# EAGLE design i2c touch sensor (EAGLE 5.10)
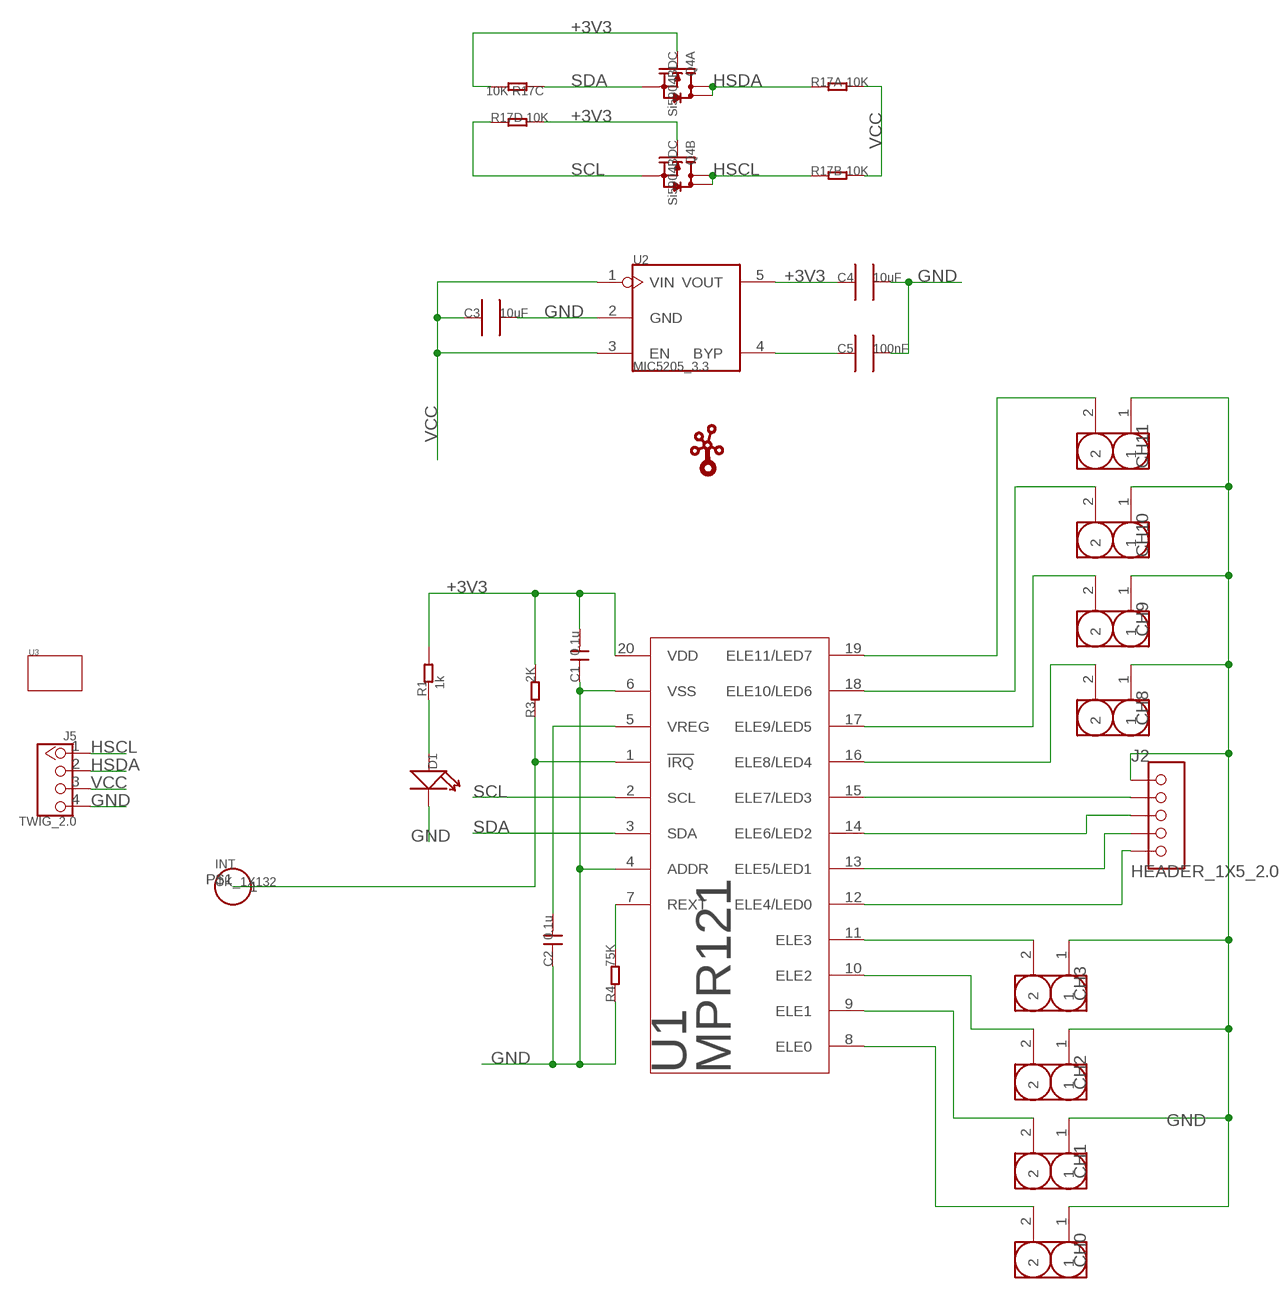
[diagram p0: schematic, sheet 1]

## Parts
C1  0.1u  006-C0603  [0603]
C2  0.1u  006-C0603  [0603]
C3  10uF  C0805_S  [0805_S]
C4  10uF  C0805_S  [0805_S]
C5  100nF  C0603_S  [0603_S]
CH0  HEADER_1X2_2.0  HEADER-2P  [2P-2.0-0.7MM/]
CH1  HEADER_1X2_2.0  HEADER-2P  [2P-2.0-0.7MM/]
CH2  HEADER_1X2_2.0  HEADER-2P  [2P-2.0-0.7MM/]
CH3  HEADER_1X2_2.0  HEADER-2P  [2P-2.0-0.7MM/]
CH8  HEADER_1X2_2.0  HEADER-2P  [2P-2.0-0.7MM/]
CH9  HEADER_1X2_2.0  HEADER-2P  [2P-2.0-0.7MM/]
CH10  HEADER_1X2_2.0  HEADER-2P  [2P-2.0-0.7MM/]
CH11  HEADER_1X2_2.0  HEADER-2P  [2P-2.0-0.7MM/]
D1  LED-0805  [D0805]
INT  CK_1X132  [CK_1X1]
J2  HEADER_1X5_2.0  [2.0_1X5P]
J5  TWIG_2.0  [2.0_1X4]
Q4  Si5904BDC  010-DUAL-N-MOSFET_1206-8  [1206-8]
R1  1k  R0603  [0603]
R3  2K  005-R0603  [0603]
R4  75K  005-R0603  [0603]
R17  10K  005-4R_1206  [R1206-8]
U1  MPR121  [MPR121]
U2  MIC5205_3.3  MIC5025_X.X  [SOT23-5]
U3  TWIG-2U  [2U-DIM-W/-DRILL]
U$2  TWIGLOGOTWIGLOGO_SMALL  [TWIGLOGO_SMALL]

## Nets
+3V3: C1.2 C4.1 Q4.2(A:G) Q4.4(B:G) R1.2 R3.2 R17.5 R17.6 U1.20(VDD) U2.5(VOUT)
GND: C1.1 C2.1 C3.2 C4.2 C5.2 CH0.1 CH1.1 CH2.1 CH3.1 CH8.1 CH9.1 CH10.1 CH11.1 D1.- J2.1 J5.4 R4.1 U1.4(ADDR) U1.6(VSS) U2.2(GND)
HSCL: J5.1 Q4.5(B:D) Q4.6(B:D) R17.2
HSDA: J5.2 Q4.7(A:D) Q4.8(A:D) R17.1
N$1: J2.4 U1.13(ELE5/LED1)
N$2: CH2.2 U1.10(ELE2)
N$3: INT.P$1 R3.1 U1.1(!IRQ)
N$4: C2.2 U1.5(VREG)
N$5: R4.2 U1.7(REXT)
N$6: CH1.2 U1.9(ELE1)
N$7: CH0.2 U1.8(ELE0)
N$8: J2.2 U1.15(ELE7/LED3)
N$9: CH3.2 U1.11(ELE3)
N$10: J2.5 U1.12(ELE4/LED0)
N$11: D1.+ R1.1
N$12: J2.3 U1.14(ELE6/LED2)
N$14: CH8.2 U1.16(ELE8/LED4)
N$15: CH9.2 U1.17(ELE9/LED5)
N$16: CH10.2 U1.18(ELE10/LED6)
N$17: CH11.2 U1.19(ELE11/LED7)
N$18: C5.1 U2.4(BYP)
SCL: Q4.3(B:S) R17.4 U1.2(SCL)
SDA: Q4.1(A:S) R17.3 U1.3(SDA)
VCC: C3.1 J5.3 R17.7 R17.8 U2.1(VIN) U2.3(EN)

## Library data of the parts
C1 C2 = Discrete:006-C*: Ceramic Capacitors
C3 C4 = CPT_SMD:C0805
C5 = CPT_SMD:C0603
CH0 CH1-CH3 CH8-CH11 = Connector:HEADER-2P
D1 = Discrete:LED*
INT = CONNECTER2:CK_1X1
J2 = CONNECTER:HEADER_1X5
J5 = CONNECTER:TWIG_2.0
Q4 = Discrete:010-DUAL-N-MOSFET*: Si5902BDC Si5904DC Si5908DC Si5920DC
R1 = CPT_SMD:R0603
R3 R4 = Discrete:005-R*
R17 = Discrete:005-4R*: Resistor Array
U1 = LG_seed:MPR121
U2 = ICs_v54:MIC5025_X.X
U3 = Module:TWIG
U$2 = seeedleo:TWIGLOGO

## Net classes
1 power: width 0.508 mm, drill 0.508 mm, clearance 0.508 mm

## Board
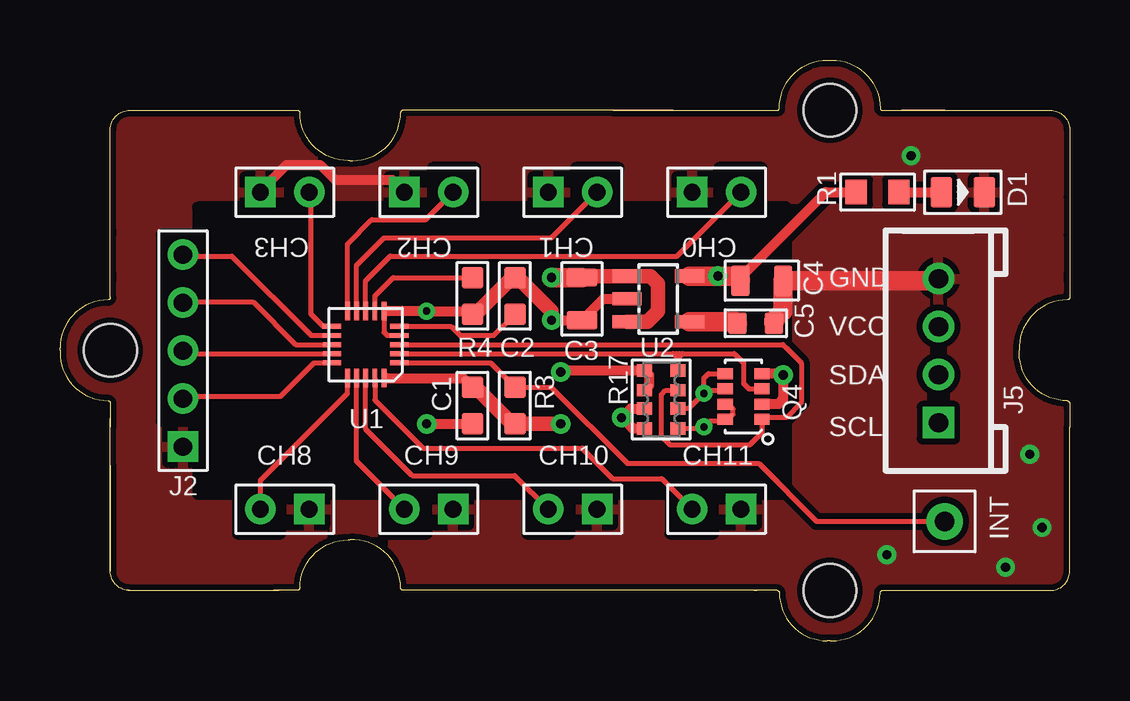
[diagram p1: board, top side]
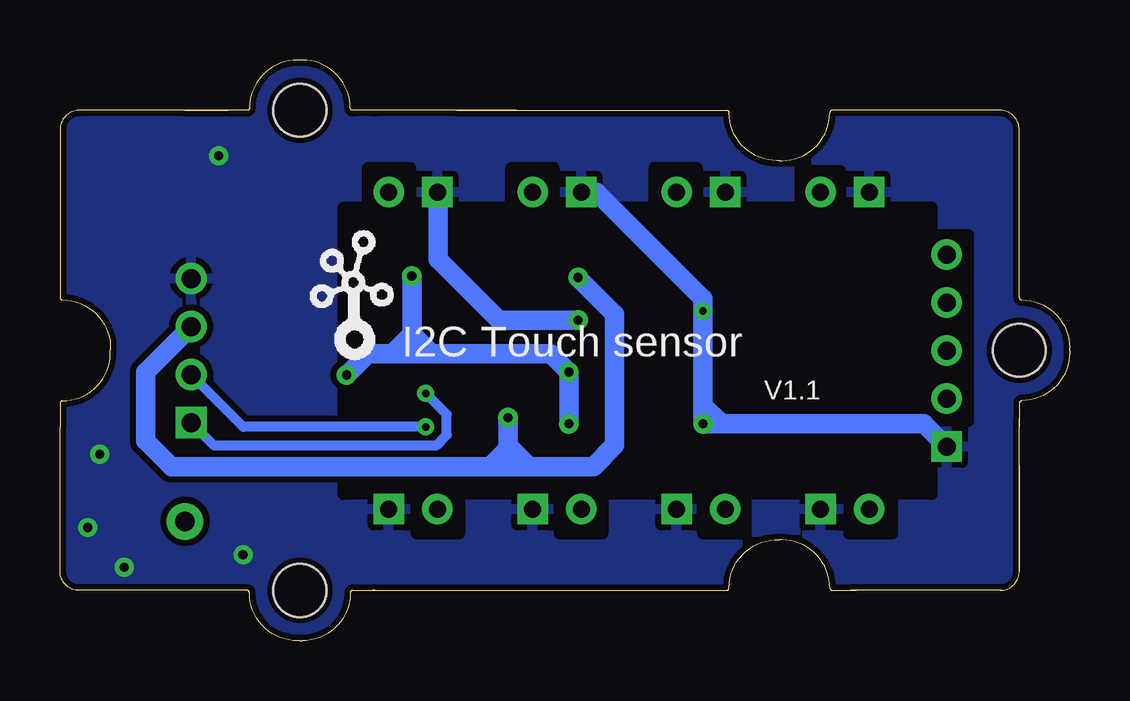
[diagram p2: board, bottom side, seen from below]

Size 42.09 x 24.2 mm. Coordinates in mm from the lower left corner, seen from the top.
Copper layers (1*16): Top 0.035mm / dielectric 1.5mm / Bottom 0.035mm
Design rules "default *": minimum track width 8mil, minimum drill 12mil, track to track 6mil, track to pad 6mil, pad to pad 6mil, via to via 6mil, smd to smd 6mil, copper to edge 10mil, drill to drill 8mil, minimum pad ring 10mil, minimum via ring 8mil, stop-mask expansion 4mil, vias tented up to drill 25mil, thermal gap 10mil
tRestrict: area 15.5,17.7 to 17.3,19.7; area 21.5,17.7 to 23.3,19.7; area 27.5,17.7 to 29.3,19.7; area 25.4,4.5 to 27.2,6.5; area 19.5,4.5 to 21.3,6.5; area 13.5,4.5 to 15.3,6.5; area 7.4,4.5 to 9.2,6.5; area 4.2,9.2 to 6.1,16.9; area 9.6,17.7 to 11.2,19.6; area 5.8,6.1 to 30.3,18.1
bRestrict: area 7.4,4.5 to 9.2,6.5; area 13.5,4.5 to 15.3,6.5; area 19.5,4.5 to 21.3,6.5; area 25.4,4.5 to 27.2,6.5; area 27.5,17.7 to 29.3,19.7; area 21.5,17.7 to 23.3,19.7; area 15.5,17.7 to 17.3,19.7; area 4.2,9.2 to 6.1,16.9; area 9.6,17.7 to 11.2,19.6; area 5.8,6.1 to 30.3,18.1

### Footprints (pad centres in the part's own frame; a part is rotated, then mirrored left to right if it is on the bottom)
0603 = smd 0.889 x 0.889: 1 -0.762,0; 2 0.762,0
0805_S = smd 0.762 x 1.27: 1 -0.889,0; 2 0.889,0
0603_S = smd 0.762 x 0.889: 1 -0.762,0; 2 0.762,0
2P-2.0-0.7MM/ = drill 0.7 pad 1.27 square: 1 -1.016,0 | drill 0.7 pad 1.27 round: 2 1.016,0
D0805 = smd 0.889 x 1.27: + -0.889,0; - 0.889,0
CK_1X1 = drill 0.813 pad 1.524 round: P$1 0,0
2.0_1X5P = drill 0.762 pad 1.27 square: 1 0,4 | drill 0.762 pad 1.27 round: 2 0,2; 3 0,0; 4 0,-2; 5 0,-4
2.0_1X4 = drill 0.8 pad 1.27 square: 1 -3,0 | drill 0.8 pad 1.27 round: 2 -1,0; 3 1,0; 4 3,0
1206-8 = smd 0.457 x 0.635: 1 -0.953,-0.762; 2 -0.318,-0.762; 3 0.318,-0.762; 4 0.953,-0.762; 5 0.953,0.762; 6 0.318,0.762; 7 -0.318,0.762; 8 -0.953,0.762
0603' = smd 0.889 x 1.016: 1 -0.889,0; 2 0.889,0
R1206-8 = smd 0.508 x 0.635: 1 -1.206,-0.699; 2 -0.381,-0.699; 3 0.381,-0.699; 4 1.206,-0.699; 5 1.206,0.699; 6 0.381,0.699; 7 -0.381,0.699; 8 -1.206,0.699
MPR121 = smd 0.762 x 0.203: 1 -1.397,0.762; 2 -1.397,0.381; 3 -1.397,0; 4 -1.397,-0.381; 5 -1.397,-0.762; 11 1.397,-0.762; 12 1.397,-0.381; 13 1.397,0; 14 1.397,0.381; 15 1.397,0.762 | smd 0.203 x 0.762: 6 -0.762,-1.397; 7 -0.381,-1.397; 8 0,-1.397; 9 0.381,-1.397; 10 0.762,-1.397; 16 0.762,1.397; 17 0.381,1.397; 18 0,1.397; 19 -0.381,1.397; 20 -0.762,1.397
SOT23-5 = smd 0.55 x 1.2: 1 -0.95,-1.3; 2 0,-1.3; 3 0.95,-1.3; 4 0.95,1.3; 5 -0.95,1.3
2U-DIM-W/-DRILL = hole 2.2: 10.453,-10.42; 10.453,9.58; -19.535,-0.415

### Placement (x,y rotation side)
C1  17.19,9.8 90 top
C2  18.97,14.37 270 top
C3  21.76,14.25 270 top
C4  29.26,15.01 0 top
C5  29,13.23 0 top
CH0  27.37,18.69 0 top
CH1  21.37,18.69 0 top
CH2  15.37,18.69 0 top
CH3  9.37,18.69 0 top
CH8  9.37,5.48 180 top
CH9  15.37,5.48 180 top
CH10  21.37,5.48 180 top
CH11  27.37,5.48 180 top
D1  37.64,18.69 0 top
INT  36.88,4.98 0 top
J2  5.13,12.09 180 top
J5  36.62,12.09 90 top
Q4  28.49,10.18 90 top
R1  1k  [0603']  34.08,18.69 180 top
R3  18.97,9.8 270 top
R4  17.19,14.37 90 top
R17  25.06,10.06 90 top
U1  12.75,12.34 180 top
U2  24.94,14.25 270 top
U3  21.64,12.52 0 top
U$2  32.05,11.58 0 bottom

### Tracks (layer width: path | path; a pad name or v marks a point on that pad's centre or on a via)
+3V3  (via drill 0.38 pad 0.81)
  Top 0.203: U1.20 13.63,10.95
  Top 0.406: R17.6 24.56,10.63 24.56,11.07 R17.5 20.94,11.26 v20.87,11.2 | 13.63,10.95 16.81,10.95 C1.2 | Q4.2 29.95,9.87 30.14,10.06 v30.14,11.07 30.08,11.14 Q4.4 | C4.1 28.37,15.14 31.92,18.69 R1.2
  Top 0.61: v20.87,9.04 R3.2 18.84,9.04 17.32,10.56 C1.2
  Top 0.813: U2.5 v27.42,15.2 28.18,15.2 C4.1
  Bottom 0.813: v20.87,9.04 v20.87,11.2 21.64,11.96 26.59,11.96 | v30.14,11.07 29.26,11.96 28.24,11.96 | 26.59,11.96 27.35,11.96 | 27.42,12.8 27.42,12.03 27.35,11.96 | 27.42,12.8 v27.42,15.2 | 26.59,11.96 27.42,12.8 | 27.35,11.96 28.24,11.96 | 28.24,11.96 27.48,12.72 27.48,12.09
GND  (via drill 0.3 pad 0.64, 0.38, 0.38 pad 0.81)
  Top 0.203: U1.4 13.63,12.72 13.51,12.85 U1.6 13.63,13.74
  Top 0.406: U2.2 22.65,14.25 C3.2 v20.49,13.36 | 13.63,13.74 v15.29,13.74 17.06,13.74 R4.1 | v15.29,9.04 C1.1 | CH3.1 8.36,18.75 9.44,19.84 10.84,19.84 11.48,19.2 13.85,19.2 CH2.1
  Top 0.61: R4.1 17.32,13.61 18.84,15.14 C2.1 19.1,15.14 20.49,13.74 v20.49,13.36
  Top 0.813: C5.2 29.76,13.36 30.14,13.74 C4.2 36.54,15.01 J5.4
  Bottom 0.406: 15.29,9.17 15.41,9.04 v15.29,9.04
  Bottom 0.813: 14.52,9.04 6.08,9.04 J2.1 | 14.52,9.04 v15.29,9.04 15.29,9.8 | 15.29,9.8 v15.29,13.74 15.29,14.25 19.72,18.68 20.37,18.68 | v20.49,13.36 23.79,13.36 26.33,15.9 26.33,18.67 CH0.1 | 14.52,9.04 15.29,9.8
  other vias: 34.46,3.58 39.41,3.07 40.43,7.77 35.48,20.22 40.94,4.72
  pour Bottom (isolate 0.254): 2.08,22.38 29.76,22.38 arc-90 31.54,24.15 32.56,24.15 arc-90 34.34,22.38 42.46,22.38 42.46,1.8 34.34,1.8 arc-90 32.3,-0.23 32.05,-0.23 arc-90 30.02,1.8 1.82,1.8 1.82,9.93 arc-90 -0.21,11.96 -0.21,12.22 arc-90 1.82,14.25 2.08,14.25
  pour Top (isolate 0.254): 2.33,22.38 29.76,22.38 arc-90 31.54,24.15 32.05,24.15 32.56,24.15 arc-90 34.34,22.38 42.46,22.38 42.46,1.8 34.34,1.8 arc-90 32.3,-0.23 32.05,-0.23 arc-90 30.02,1.8 1.82,1.8 1.82,9.93 arc-90 -0.21,11.96 -0.21,12.22 arc-90 1.82,14.25 2.08,14.25 2.08,22.38
HSCL  (via drill 0.3 pad 0.64)
  Top 0.203: R17.2 26.21,9.68 v26.84,10.31 | v26.84,10.31 26.97,10.44 27.67,10.44 Q4.6 | Q4.5 27.03,11.14 26.84,10.95 v26.84,10.31
  Bottom 0.406: 26.96,10.2 v26.84,10.31 25.97,9.44 25.97,8.58 26.42,8.13 35.66,8.13 J5.1
HSDA  (via drill 0.3 pad 0.64)
  Top 0.203: R17.1 26.78,8.85 v26.84,8.91 27.1,9.17 27.67,9.17 Q4.8 27.8,9.29 27.91,9.29 28.05,9.44 28.05,9.66 27.85,9.87 Q4.7
  Bottom 0.406: v26.84,8.91 34.45,8.91 J5.2
N$1
  Top 0.203: U1.13 9.82,12.34 8.05,14.12 5.16,14.12 J2.4
N$2
  Top 0.203: U1.10 11.98,16.53 13,17.55 15.24,17.55 CH2.2
N$3
  Top 0.203: INT.P$1 31.54,4.98 29.13,7.39 23.65,7.39 20.48,10.56 R3.1 17.95,11.58 U1.1
N$4
  Top 0.203: U1.5 16.3,13.1 16.68,12.72 18.08,12.72 C2.2
N$5
  Top 0.203: U1.7 13.13,14.37 13.89,15.14 R4.2
N$6
  Top 0.203: U1.9 12.36,15.64 13.51,16.79 20.48,16.79 CH1.2
N$7
  Top 0.203: U1.8 12.75,15.01 13.76,16.03 25.72,16.03 CH0.2
N$8
  Top 0.203: U1.15 10.59,11.58 9.19,10.18 5.22,10.18 J2.2
N$9
  Top 0.203: U1.11 10.97,13.1 10.46,13.61 10.46,18.62 CH3.2
N$10
  Top 0.203: U1.12 10.46,12.72 7.16,16.03 5.19,16.03 J2.5
N$11
  Top 0.406: R1.1 D1.+
N$12
  Top 0.203: U1.14 5.25,11.96 J2.3
N$14
  Top 0.203: U1.16 11.98,10.31 8.36,6.68 CH8.2
N$15
  Top 0.203: U1.17 12.36,7.48 CH9.2
N$16
  Top 0.203: U1.18 12.75,8.82 14.68,6.88 18.96,6.88 CH10.2
N$17
  Top 0.203: U1.19 13.13,10.03 15.13,8.02 21.76,8.02 23.03,6.75 25.09,6.75 CH11.2
N$18
  Top 0.813: U2.4 28.17,13.3 C5.1
SCL
  Top 0.203: U1.2 25.57,11.96 | 25.7,11.96 25.83,11.96 | 25.76,11.77 25.76,11.9 25.83,11.96 | 25.83,11.83 25.95,11.96 | 25.83,11.96 25.95,11.96 | 25.7,11.96 25.83,11.83 | 25.83,11.83 25.7,11.83 25.57,11.96 | 25.57,11.96 25.7,11.96 | 25.83,11.96 25.83,11.83 | 25.76,11.77 R17.4 | 25.83,11.83 25.76,11.77 | 25.95,11.96 28.11,11.96 28.49,11.58 28.49,10.72 28.71,10.5 Q4.3
SDA
  Top 0.203: R17.3 25.24,10.44 25.06,10.26 25.06,8.53 25.45,8.15 28.75,8.15 29.26,8.66 Q4.1 29.32,9.29 30.27,9.29 30.91,9.93 30.91,11.58 30.27,12.22 30.14,12.34 U1.3
VCC  (via drill 0.38 pad 0.81)
  Top 0.406: R17.8 23.86,8.85 v23.41,9.29 23.79,9.68 R17.7
  Top 0.61: U2.3 24.5,13.3 24.94,13.74 24.94,14.88 24.62,15.2 U2.1 21.82,15.2 C3.1
  Top 0.813: v20.49,15.14 C3.1
  Bottom 0.406: 23.29,7.26 23.41,7.39
  Bottom 0.813: v20.49,15.14 18.97,13.61 18.97,8.15 19.86,7.26 22.52,7.26 | 22.52,7.26 23.29,7.26 24.18,7.26 | 23.41,8.02 23.41,7.39 | 23.41,8.15 23.41,8.02 | 23.41,8.02 24.18,7.26 | 22.52,7.26 23.41,8.15 | 23.41,8.15 v23.41,9.29 | 24.18,7.26 27.35,7.26 | 27.35,7.26 | 27.35,7.26 37.43,7.26 38.51,8.34 38.51,11.2 J5.3

### Text on the board
tPlace: GND | VCC | SDA | SCL
bPlace: I2C Touch sensor | V1.1